# EAGLE design gas-sensor-mics-6814-mk-1.0 (EAGLE 7.5.0)
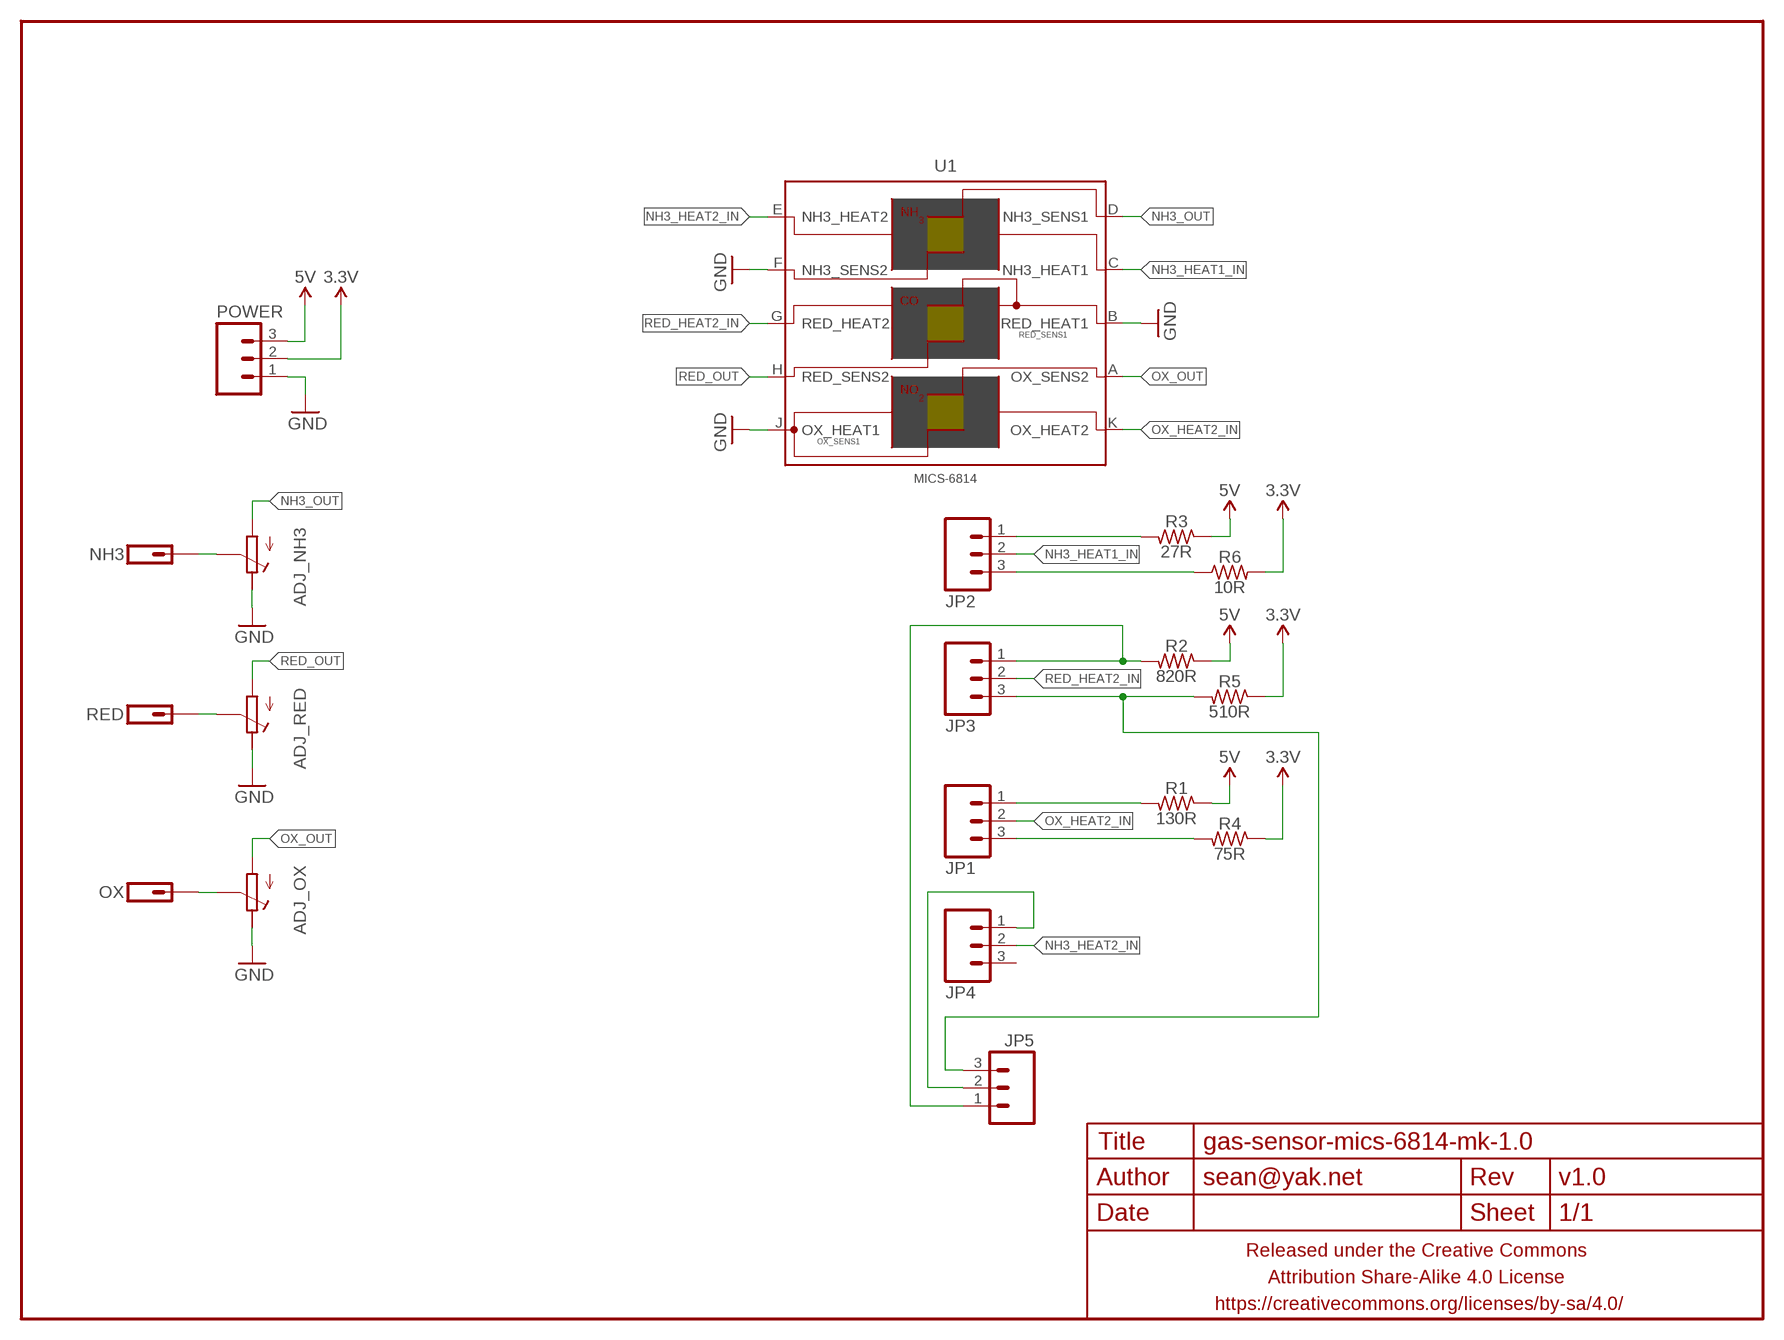
[diagram p0: schematic, sheet 1]

## Parts
ADJ_NH3  POTENTIOMETEREVM3Y  [EVM3Y]
ADJ_OX  POTENTIOMETEREVM3Y  [EVM3Y]
ADJ_RED  POTENTIOMETEREVM3Y  [EVM3Y]
FRAME1  FRAME-LETTERNO_PACKAGE  [DUMMY]
JP1  M03PTH-CENTERED  [1X03-CENTERED]
JP2  M03PTH-CENTERED  [1X03-CENTERED]
JP3  M03PTH-CENTERED  [1X03-CENTERED]
JP4  M03PTH-CENTERED  [1X03-CENTERED]
JP5  M03PTH-CENTERED  [1X03-CENTERED]
NH3  M01PTH-2MM-OFFSET  [1X01_2MM_OFFSET]
OX  M01PTH-2MM-OFFSET  [1X01_2MM_OFFSET]
POWER  M03PTH-CENTERED  [1X03-CENTERED]
R1  130R  RESISTORR0603-TIGHTER  [R0603-TIGHTER]
R2  820R  RESISTORR0603-TIGHTER  [R0603-TIGHTER]
R3  27R  RESISTORR0603-TIGHTER  [R0603-TIGHTER]
R4  75R  RESISTORR0603-TIGHTER  [R0603-TIGHTER]
R5  510R  RESISTORR0603-TIGHTER  [R0603-TIGHTER]
R6  10R  RESISTORR0603-TIGHTER  [R0603-TIGHTER]
RED  M01PTH-2MM-OFFSET  [1X01_2MM_OFFSET]
U1  MICS-6814  [MICS-10-PIN]

## Nets
3.3V: POWER.2 R4.1 R5.1 R6.2
5V: POWER.3 R1.1 R2.1 R3.1
GND: ADJ_NH3.E ADJ_OX.E ADJ_RED.E POWER.1 U1.B(RED_HEAT1) U1.F(NH3_SENS2) U1.J(OX_HEAT1)
N$1: JP2.1 R3.2
N$2: ADJ_NH3.S NH3.1
N$3: ADJ_RED.S RED.1
N$5: ADJ_OX.S OX.1
N$6: JP1.1 R1.2
N$7: JP1.3 R4.2
N$8: JP2.3 R6.1
N$11: JP3.3 JP5.3 R5.2
N$12: JP3.1 JP5.1 R2.2
N$13: JP4.1 JP5.2
NH3_HEAT1_IN: JP2.2 U1.C(NH3_HEAT1)
NH3_HEAT2_IN: JP4.2 U1.E(NH3_HEAT2)
NH3_OUT: ADJ_NH3.A U1.D(NH3_SENS1)
OX_HEAT2_IN: JP1.2 U1.K(OX_HEAT2)
OX_OUT: ADJ_OX.A U1.A(OX_SENS2)
RED_HEAT2_IN: JP3.2 U1.G(RED_HEAT2)
RED_OUT: ADJ_RED.A U1.H(RED_SENS2)
Unconnected: JP4.3

## Library data of the parts
ADJ_NH3 ADJ_OX ADJ_RED = a_parts:POTENTIOMETER: Trimm resistor
FRAME1 = A_butts:FRAME-LETTER: Schematic Frame Standard 8.5x11 US Letter frame; DESIGNER: sean@yak.net; VERSION: v1.0
JP1-JP5 POWER = a_parts:M03: Header 3 Standard 3-pin 0.1" header. Use with straight break away headers (SKU : PRT-00116), right angle break away headers (PRT-00553), swiss pins (PRT-00743), machine pins (PRT-00117), and female headers (PRT-00115). Molex polarized connector foot print use with SKU : PRT-08232 with associated crimp pins and housings.
NH3 OX RED = a_parts:M01: Header 1 Standard 1-pin 0.1" header. Use with straight break away headers (SKU : PRT-00116), right angle break away headers (PRT-00553), swiss pins (PRT-00743), machine pins (PRT-00117), and female headers (PRT-00115).
R1-R6 = a_parts:RESISTOR: RESISTOR, American symbol
U1 = a_parts:MICS-6814

## Board
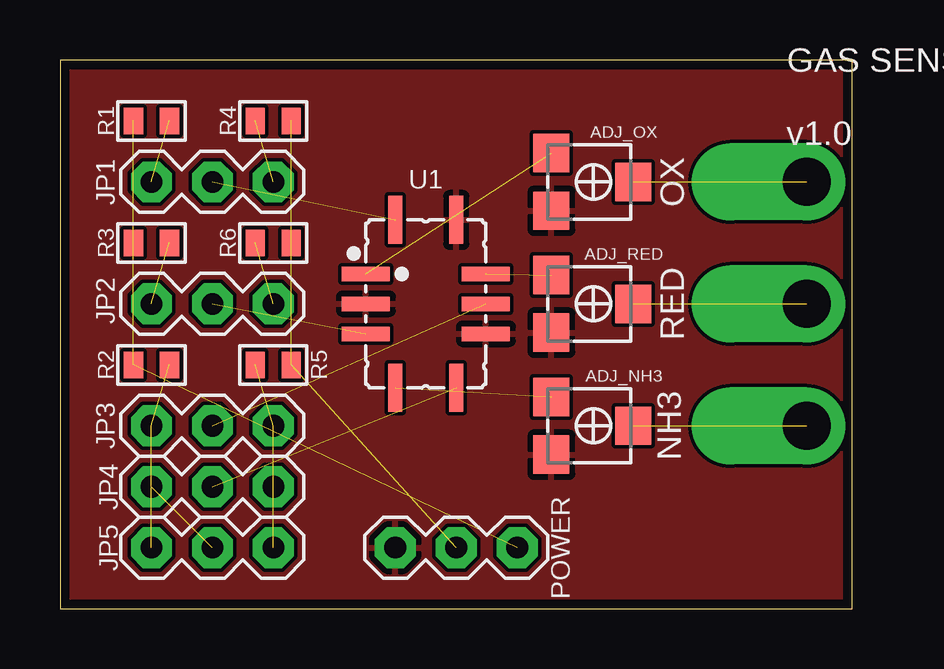
[diagram p1: board, top side]
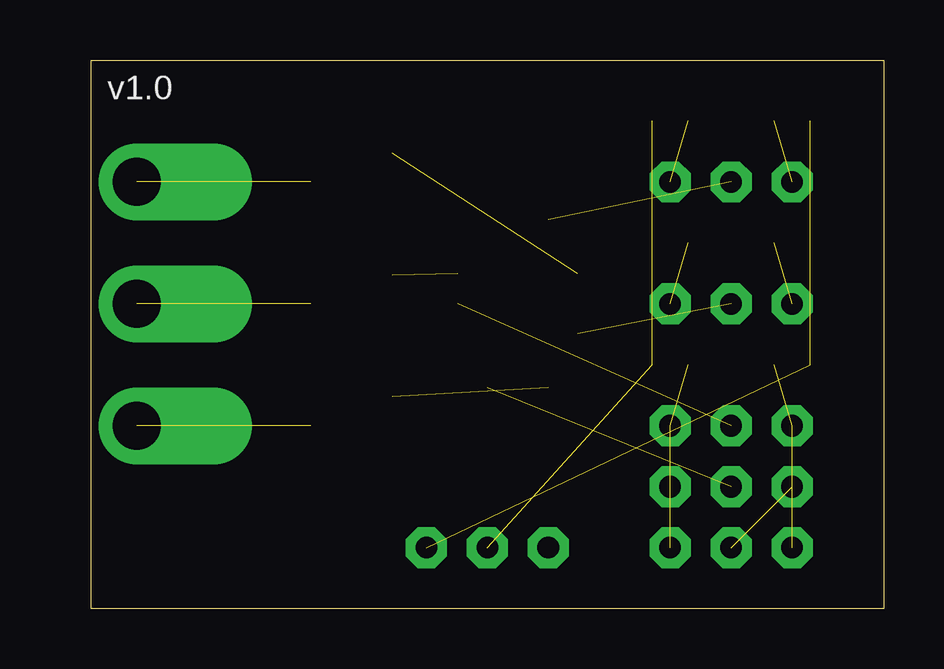
[diagram p2: board, bottom side, seen from below]

Size 33.02 x 22.86 mm. Coordinates in mm from the lower left corner, seen from the top.
Outline: 0,22.86 0,0 33.02,0 33.02,22.86 0,22.86
Copper layers (1*16): Top 0.0356mm / dielectric 1.5011mm / Bottom 0.0356mm
Design rules "LaenPCBOrder_2": minimum track width 6mil, minimum drill 13mil, track to track 6mil, track to pad 6mil, pad to pad 6mil, via to via 6mil, smd to smd 6mil, copper to edge 15mil, drill to drill 6mil, minimum pad ring 7mil, minimum via ring 7mil, stop-mask expansion 3mil, vias tented up to drill 20mil, thermal gap 10mil

### Footprints (pad centres in the part's own frame; a part is rotated, then mirrored left to right if it is on the bottom)
EVM3Y = smd 1.6 x 1.5: A -1.2,-1.75; E 1.2,-1.75; S 0,1.65
1X03-CENTERED = drill 0.9 pad 1.7 octagon: 1 -2.54,0; 2 0,0; 3 2.54,0
1X01_2MM_OFFSET = drill 2 pad 3.2 offset: 1 0,0
R0603-TIGHTER = smd 0.8 x 1.1: 1 -0.75,0; 2 0.75,0
MICS-10-PIN = smd 0.6 x 2: A -1.25,-2.5; B 0,-2.5; C 1.25,-2.5; F 1.25,2.5; G 0,2.5; H -1.25,2.5 | smd 2 x 0.6: D 3.5,-1.27; E 3.5,1.27; J -3.5,1.27; K -3.5,-1.27

### Placement (x,y rotation side)
ADJ_NH3  22.23,7.62 270 top
ADJ_OX  22.23,17.78 270 top
ADJ_RED  22.23,12.7 270 top
FRAME1  0,0 0 top
JP1  6.35,17.78 0 top
JP2  6.35,12.7 0 top
JP3  6.35,7.62 0 top
JP4  6.35,5.08 0 top
JP5  6.35,2.54 0 top
NH3  31.11,7.62 270 top
OX  31.11,17.78 270 top
POWER  16.51,2.54 0 top
R1  3.81,20.32 0 top
R2  3.81,10.16 0 top
R3  3.81,15.24 0 top
R4  8.89,20.32 180 top
R5  8.89,10.16 180 top
R6  8.89,15.24 0 top
RED  31.11,12.7 270 top
U1  15.24,12.7 270 top

### Tracks (layer width: path | path; a pad name or v marks a point on that pad's centre or on a via)
3.3V  (3 unrouted)
5V  (3 unrouted)
GND
  pour Top: 0,0 33.02,0 33.02,22.86 0,22.86
N$1  (1 unrouted)
N$2  (1 unrouted)
N$3  (1 unrouted)
N$5  (1 unrouted)
N$6  (1 unrouted)
N$7  (1 unrouted)
N$8  (1 unrouted)
N$11  (2 unrouted)
N$12  (2 unrouted)
N$13  (1 unrouted)
NH3_HEAT1_IN  (1 unrouted)
NH3_HEAT2_IN  (1 unrouted)
NH3_OUT  (1 unrouted)
OX_HEAT2_IN  (1 unrouted)
OX_OUT  (1 unrouted)
RED_HEAT2_IN  (1 unrouted)
RED_OUT  (1 unrouted)

### Text on the board
tPlace: GAS SENSOR